# Altium schematic sheet MT7601.SchDoc
size A4
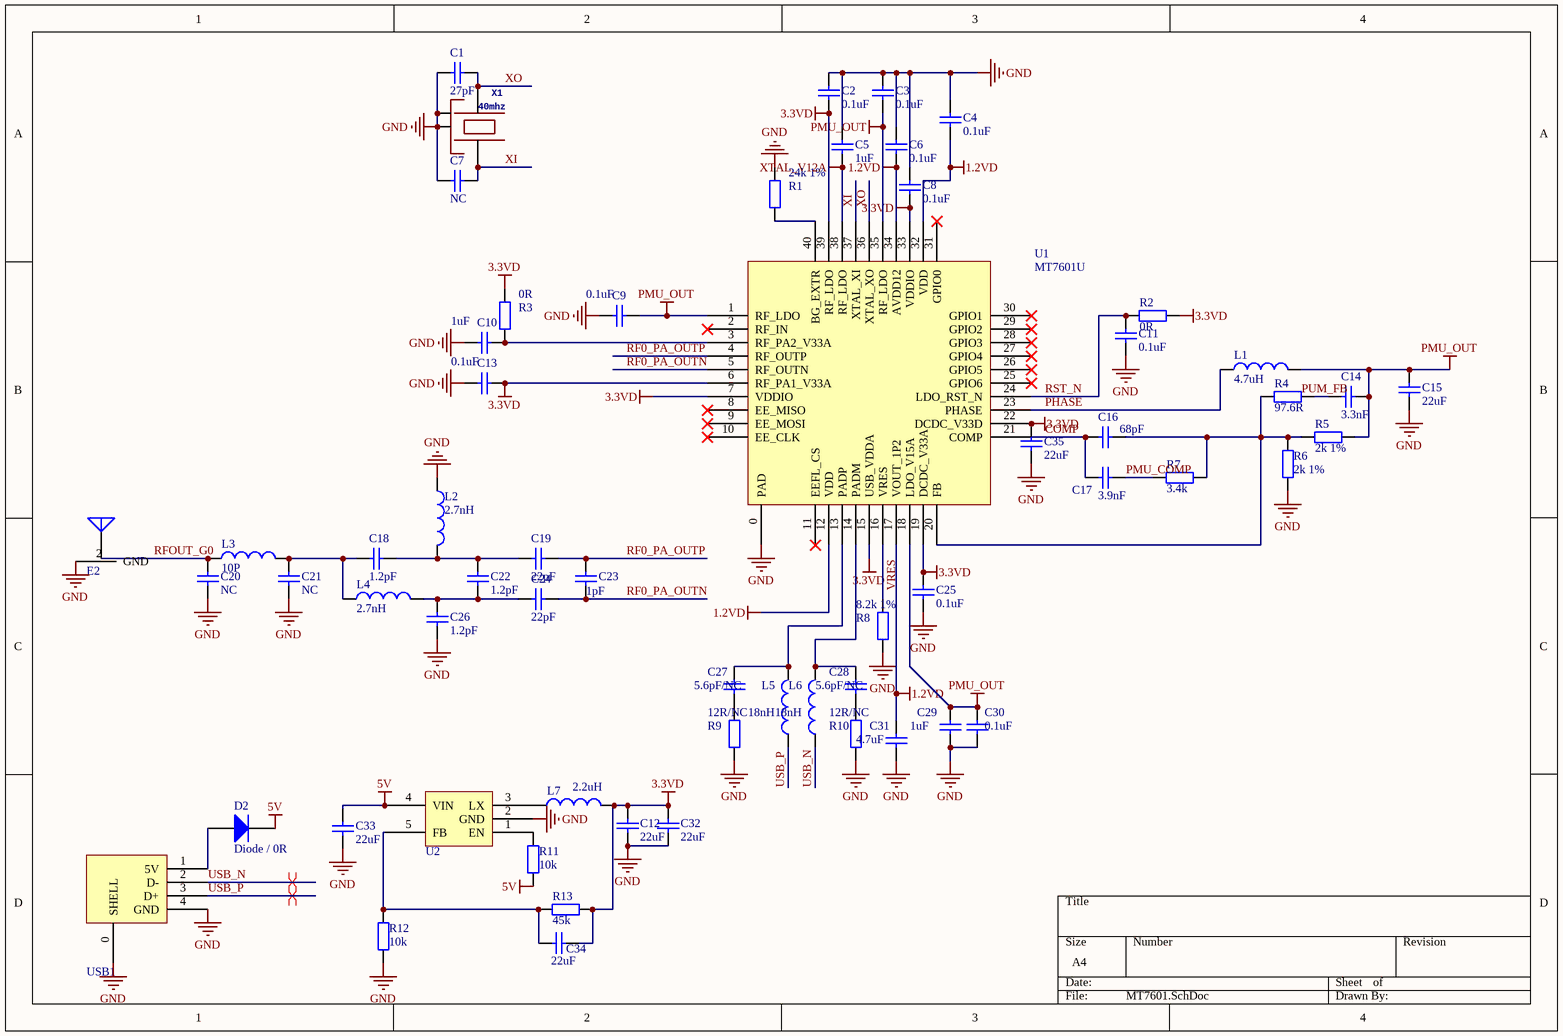
[diagram p0: MT7601.SchDoc]

## Parts
C1  27pF  [0402]
C2  0.1uF  [0402]
C3  0.1uF  [0402]
C4  0.1uF  [0402]
C5  1uF  [0402]
C6  0.1uF  [0402]
C7  NC  [0402]
C8  0.1uF  [0402]
C9  0.1uF  [0402]
C10  1uF  [0402]
C11  0.1uF  [0402]
C12  value 22uF  [0805]  (hidden comment: Cap)
C13  0.1uF  [0402]
C14  3.3nF  [0402]
C15  value 22uF  [0805]  (hidden comment: Cap)
C16  68pF  [0402]
C17  3.9nF  [0402]
C18  1.2pF  [0402]
C19  22pF  [0402]
C20  NC  [0402]
C21  NC  [0402]
C22  1.2pF  [0402]
C23  1pF  [0402]
C24  22pF  [0402]
C25  0.1uF  [0402]
C26  1.2pF  [0402]
C27  5.6pF/NC  [0402]
C28  5.6pF/NC  [0402]
C29  1uF  [0402]
C30  0.1uF  [0402]
C31  4.7uF  [0603]
C32  value 22uF  [0805]  (hidden comment: Cap)
C33  value 22uF  [0805]  (hidden comment: Cap)
C34  value 22uF  [0402]  (hidden comment: Cap)
C35  value 22uF  [0805]  (hidden comment: Cap)
D2  Diode / 0R  [0805]
E2  Antenna  [IPEX]  (value not drawn)
L1  4.7uH  [0805]
L2  2.7nH  [0402]
L3  10P  [0402]
L4  2.7nH  [0402]
L5  18nH  [0402]
L6  18nH  [0402]
L7  2.2uH  [0805]
R1  24k 1%  [0402]
R2  0R  [0402]
R3  0R  [0402]
R4  97.6R  [0402]
R5  2k 1%  [0402]
R6  2k 1%  [0402]
R7  3.4k  [0402]
R8  8.2k 1%  [0402]
R9  12R/NC  [0402]
R10  12R/NC  [0402]
R11  10k  [0402]
R12  10k  [0402]
R13  45k  [0402]
U1  MT7601U  [MT7601U]
U2  RT8059  [SOT23-5]  (value not drawn)
USB1  USB-A  [USB-A-Male]  (value not drawn)
X1  40mhz  [OSCILLATOR-3.2X2.5]

## Nets
1.2VD: C4.2 C6.2 C31.1 U1.12(VDD) U1.17(VOUT_1P2) U1.32(VDD) U1.34(AVDD12)
3.3VD: C2.2 C8.2 C12.2 C13.1 C25.2 C32.2 C34.1 C35.2 L7.2 R2.1 R3.2 R13.2 U1.6(RF_PA1_V33A) U1.7(VDDIO) U1.15(USB_VDDA) U1.19(DCDC_V33A) U1.22(DCDC_V33D) U1.33(VDDIO) U1.39(RF_LDO)
5V: C33.2 D2.2(K) R11.2 U2.4(VIN)
GND: C1.1 C2.1 C3.1 C4.1 C5.1 C6.1 C7.1 C8.1 C9.2 C10.2 C11.2 C12.1 C13.2 C15.1 C20.1 C21.1 C25.1 C26.2 C29.2 C30.2 C31.2 C32.1 C33.1 C35.1 E2.2(GND) L2.1 R1.2 R6.2 R8.1 R9.1 R10.1 R12.1 U1.0(PAD) U2.2(GND) USB1.0(SHELL) USB1.4(GND) X1.2(NC_2) X1.4(NC_4)
PMU_OUT: C3.2 C9.1 C14.1 C15.2 C29.1 C30.1 L1.2 R5.1 U1.1(RF_LDO) U1.18(LDO_V15A) U1.35(RF_LDO)
XTAL_V12A: C5.2 U1.38(RF_LDO)
COMP: C16.2 C17.2 U1.21(COMP)
PHASE: L1.1 U1.23(PHASE)
PMU_COMP: C17.1 R7.2
RF0_PA_OUTN: C23.1 C24.2 U1.5(RF_OUTN)
RF0_PA_OUTP: C19.2 C23.2 U1.4(RF_OUTP)
RFOUT_G0: C20.2 E2.1(ANT) L3.1
RST_N: C11.1 R2.2 U1.24(LDO_RST_N)
USB_N: L6.1 USB1.2(D-)
USB_P: L5.1 USB1.3(D+)
VRES: R8.2 U1.16(VRES)
XI: C7.2 U1.37(XTAL_XI) X1.3
XO: C1.2 U1.36(XTAL_XO) X1.1
NetC10_1: C10.1 R3.1 U1.3(RF_PA2_V33A)
NetC14_2: C14.2 R4.1
NetC16_1: C16.1 R4.2 R5.2 R6.1 R7.1 U1.20(FB)
NetC18_1: C18.1 C19.1 C22.1 L2.2
NetC18_2: C18.2 C21.2 L3.2 L4.1
NetC22_2: C22.2 C24.1 C26.1 L4.2
NetC27_1: C27.1 L5.2 U1.13(PADP)
NetC27_2: C27.2 R9.2
NetC28_1: C28.1 L6.2 U1.14(PADM)
NetC28_2: C28.2 R10.2
NetC34_2: C34.2 R12.2 R13.1 U2.5(FB)
NetD2_1: D2.1(A) USB1.1(5V)
NetL7_1: L7.1 U2.3(LX)
NetR1_1: R1.1 U1.40(BG_EXTR)
NetR11_1: R11.1 U2.1(EN)

Not connected (* = marked no-connect by the designer): U1 2(RF_IN)* 8(EE_MISO)* 9(EE_MOSI)* 10(EE_CLK)* 11(EEFL_CS)* 25(GPIO6)* 26(GPIO5)* 27(GPIO4)* 28(GPIO3)* 29(GPIO2)* 30(GPIO1)* 31(GPIO0)*

## Layout directives
differential pair: USB_N, USB_P

## Notes on the sheet
- Labels drawn without touching a wire or pin: PUM_FB

## Library data of the parts
C1-C35 = Cap: Capacitor; Published: 8-Jun-2000; LatestRevisionDate: 17-Jul-2002; LatestRevisionNote: Re-released for DXP Platform.; PackageReference: RAD-0.3; Publisher: Altium Limited; PackageDescription: Radial Cap, Thru-Hole; 2 Leads; 0.3 in Pin Spacing
D2 = Diode: Default Diode; Published: 8-Jun-2000; LatestRevisionDate: 17-Jul-2002; LatestRevisionNote: Re-released for DXP Platform.; PackageVersion: Sep-1996; PackageReference: SMC; Publisher: Altium Limited; PackageDescription: DO-214-AB/SMC; 2 C-Bend Leads; Body 7.9 x 5.9 mm, inc. leads (LxW); Code_JEDEC: DO-214-AB
E2 = Antenna: Generic Antenna; Published: 24-Mar-1999; LatestRevisionDate: 17-Jul-2002; LatestRevisionNote: Re-released for DXP Platform.; PackageReference: PIN1; Publisher: Altium Limited
L1-L7 = Inductor: Code_IEC: 1005; Published: 8-Jun-2000; LatestRevisionDate: 29-May-2009; LatestRevisionNote: IPC-7351 Footprint Added.; PackageReference: 0402-A; Publisher: Altium Limited; PackageDescription: Chip Inductor; Code_JEITA: 0402
R1-R13 = Res2: Resistor; Published: 8-Jun-2000; LatestRevisionDate: 17-Jul-2002; LatestRevisionNote: Re-released for DXP Platform.; PackageReference: AXIAL-0.4; Publisher: Altium Limited; PackageDescription: Axial Device, Thru-Hole; 2 Leads; 0.4 in Pin Spacing
X1 = OSCILLATOR-3.2X2.5: Crystal Oscillator in 3.2x2.5 SMD